# EAGLE design diylinear1 (EAGLE 6.6.0)
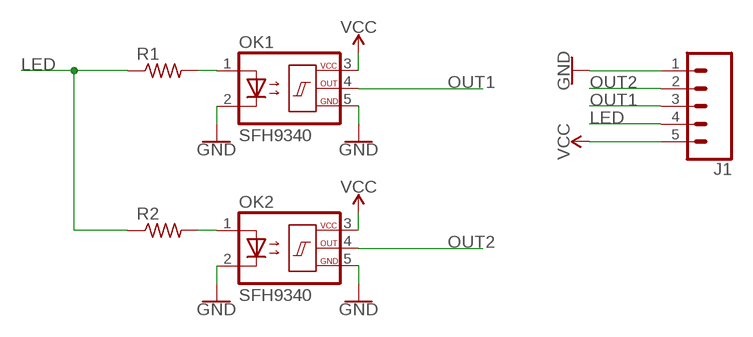
[diagram p0: schematic, sheet 1]

## Parts
J1  CONN_05  [1X05]
OK1  SFH9340  [SFH9340]
OK2  SFH9340  [SFH9340]
R1  R-US_0204/5  [0204/5]
R2  R-US_0204/5  [0204/5]

## Nets
GND: J1.1 OK1.2(C) OK1.5(GND) OK2.2(C) OK2.5(GND)
LED: J1.4 R1.1 R2.1
N$1: OK1.1(A) R1.2
N$4: OK2.1(A) R2.2
OUT1: J1.3 OK1.4(OUT)
OUT2: J1.2 OK2.4(OUT)
VCC: J1.5 OK1.3(VCC) OK2.3(VCC)

## Library data of the parts
J1 = SparkFun-Connectors:CONN_05: Multi connection point. Often used as Generic Header-pin footprint for 0.1 inch spaced/style header connections On any of the 0.1 inch spaced packages, you can populate with these: Break Away Headers - Straight <https://www.sparkfun.com/products/116> (PRT-00116) Break Away Male Headers - Right Angle <https://www.sparkfun.com/products/553> (PRT-00553) Female Headers <https://www.sparkfun.com/products/115> (PRT-00115) Break Away Headers - Machine Pin <https://www.sparkfun.com/products/117> (PRT-00117) Break Away Female Headers - Swiss Machine Pin <https://www.sparkfun.com/products/743> (PRT-00743) For SCREWTERMINALS and SPRING TERMINALS visit here: Screw Terimnals on SparkFun.com <https://www.sparkfun.com/search/results?term=Screw+Terminals> (5mm/3.5mm/2.54mm spacing) This device is also useful as a general connection point to wire up your design to another part of your project. Our various solder wires solder well into these plated through hole pads. Hook-Up Wire - Assortment (Stranded, 22 AWG) <https://www.sparkfun.com/products/11375> (PRT-11375) Hook-Up Wire - Assortment (Solid Core, 22 AWG) <https://www.sparkfun.com/products/11367> (PRT-11367) View the entire wire category on our website here <https://www.sparkfun.com/categories/141> Special notes: Molex polarized connector foot print use with SKU : PRT-08231 with associated crimp pins and housings. 1MM SMD Version SKU: PRT-10208
OK1 OK2 = optocoupler:SFH934*: Slotted Interrupter with Schmitt-Trigger-IC Gabellichtschranke mit Schmitt-Trigger IC Source: http://www.osram.convergy.de/ ... sfh9340.pdf; OC_FARNELL: unknown; OC_NEWARK: unknown
R1 R2 = resistor:R-US_: RESISTOR, American symbol

## Board
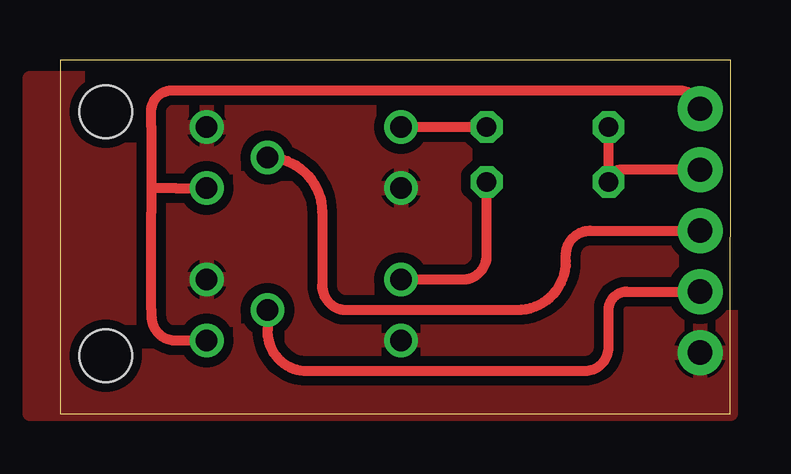
[diagram p1: board, top side]
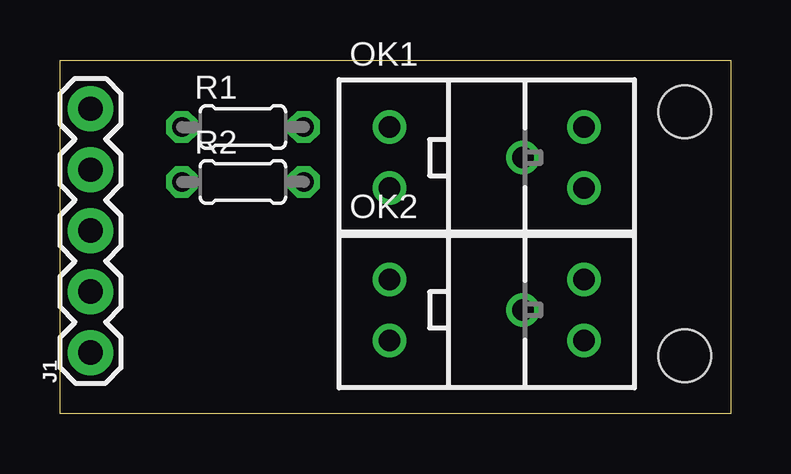
[diagram p2: board, bottom side, seen from below]

Size 27.94 x 14.73 mm. Coordinates in mm from the lower left corner, seen from the top.
Outline: 0,0 27.92,0 27.94,14.73 0,14.73 0,0
Copper layers (1*16): Top 0.035mm / dielectric 1.5mm / Bottom 0.035mm
Design rules "OthermillDRC_30_deg_v2": minimum track width 6mil, minimum drill 0.8mm, track to track 6mil, track to pad 6mil, pad to pad 6mil, via to via 6mil, smd to smd 0mil, copper to edge 0mil, drill to drill 6mil, minimum pad ring 10mil, minimum via ring 10mil, stop-mask expansion 1mil, vias tented up to drill 30mil, thermal gap 6mil
Holes 2.2 mm at 1.91,12.57 1.91,2.41

### Footprints (pad centres in the part's own frame; a part is rotated, then mirrored left to right if it is on the bottom)
1X05 = drill 1.016 pad 1.88: 1 0,0; 2 2.54,0; 3 5.08,0; 4 7.62,0; 5 10.16,0
SFH9340 = drill 0.9: 1 -4.05,1.27; 2 -4.05,-1.27; 3 4.05,-1.27; 4 1.51,0; 5 4.05,1.27
0204/5 = drill 0.813 octagon: 1 -2.54,0; 2 2.54,0

### Placement (x,y rotation side)
J1  26.67,2.54 90 bottom
OK1  10.16,10.67 0 bottom
OK2  10.16,4.32 0 bottom
R1  20.32,11.94 0 bottom
R2  20.32,9.65 0 bottom

### Tracks (layer width: path | path; a pad name or v marks a point on that pad's centre or on a via)
GND
  pour Top (isolate 0.406): -1.27,13.97 27.94,13.97 27.94,0 -1.27,0
LED
  Top 0.406: R1.1 R2.1 arc-90 23.37,10.16 J1.4
  Top 0.61: R1.1 22.86,11.67
N$1
  Top 0.406: R1.2 OK1.1
N$4
  Top 0.406: OK2.1 16.78,5.59 arc90 17.78,6.59 R2.2
OUT1
  Top 0.406: OK1.4 arc-90 10.92,8.4 10.92,5.33 arc90 11.94,4.32 18.03,4.32 19.05,4.32 arc90 21.08,6.35 21.08,6.62 arc-90 22.08,7.62 J1.3
OUT2
  Top 0.406: OK2.4 8.65,3.54 arc90 10.16,1.78 19.56,1.78 21.86,1.78 arc90 22.86,2.78 22.86,3.05 22.86,4.33 arc-90 23.61,5.08 J1.2
VCC
  Top 0.406: OK2.3 4.81,3.05 arc-90 3.81,4.05 3.81,4.32 3.81,8.4 3.81,9.4 | OK1.3 4.81,9.4 3.81,9.4 | 3.81,9.4 3.81,11.94 3.81,12.72 arc-90 4.81,13.46 6.35,13.46 25.67,13.46 arc-90 26.67,12.72 J1.5